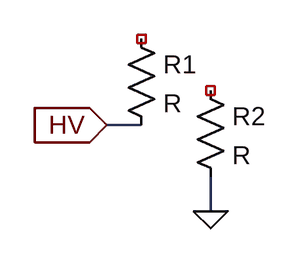
[diagram p0: schematic Draft1.asc]
Draft1.asc, the LTspice schematic file:
Version 4
SHEET 1 880 680
WIRE 128 128 96 128
WIRE 192 208 192 176
FLAG 192 208 0
FLAG 96 128 HV
IOPIN 96 128 In
SYMBOL res 112 32 R0
SYMATTR InstName R1
SYMBOL res 176 80 R0
SYMATTR InstName R2

The netlist it stands for:
* Draft1.asc
R1 NC_01 HV R
R2 NC_02 0 R
.backanno
.end